# Altium project ESP32_V1.PrjPcb
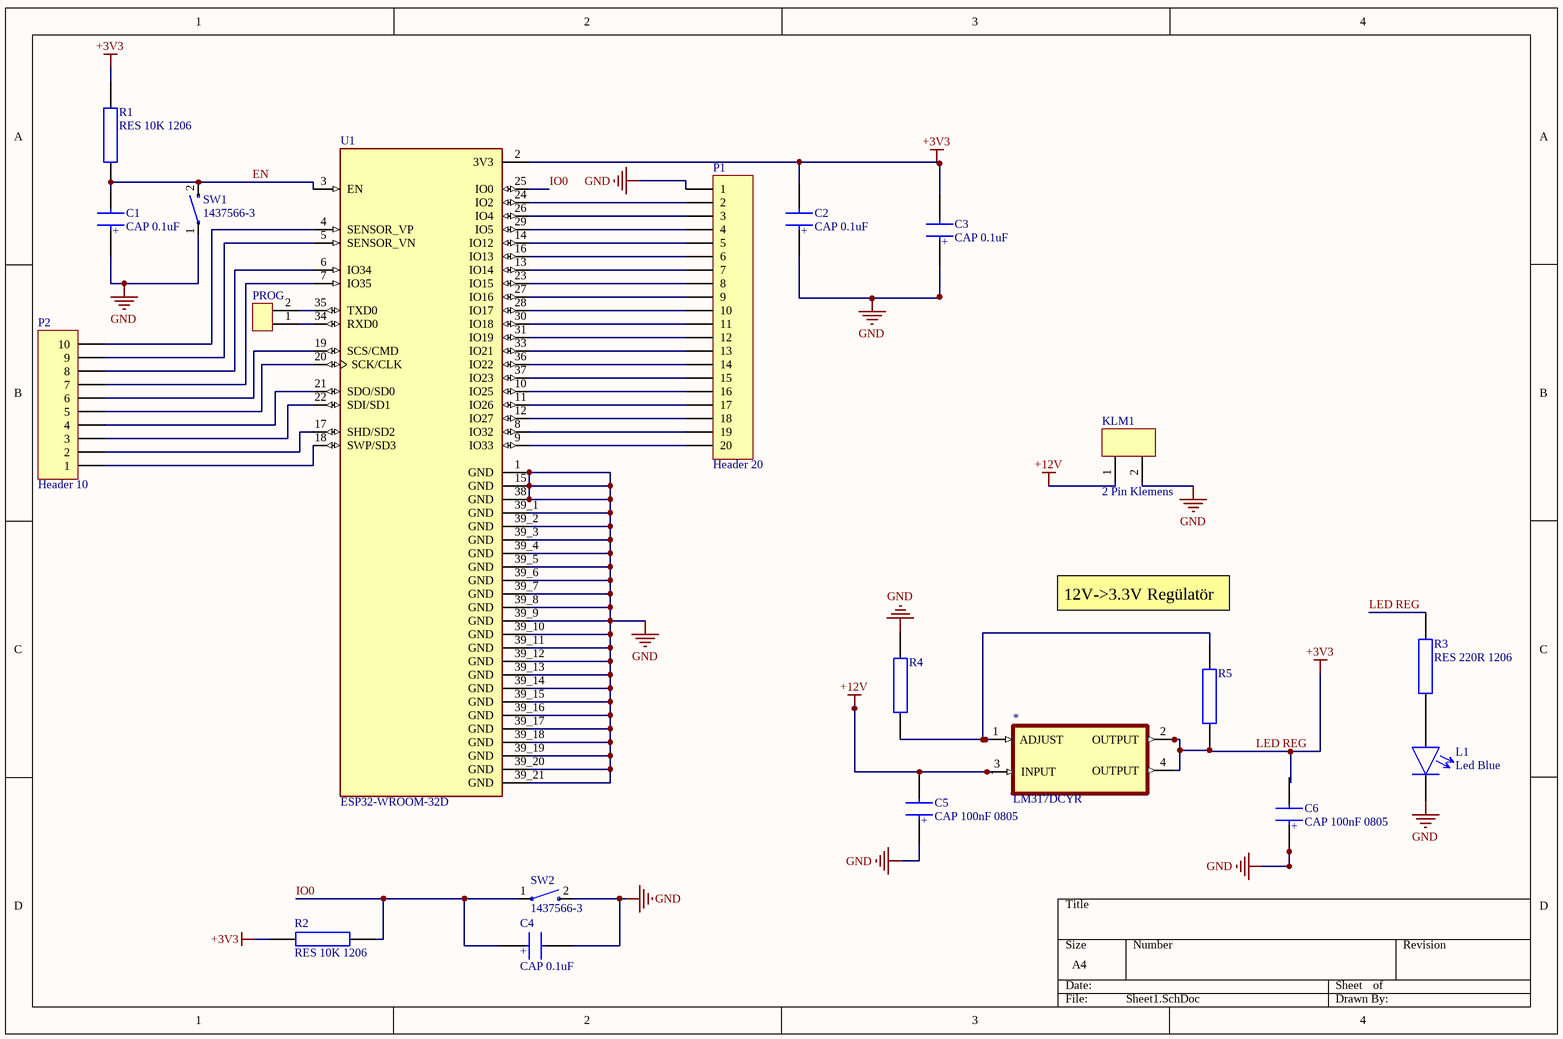
[diagram p0: Sheet1.SchDoc]
1 sheet, 20 parts. Net scope: global (net labels, ports and power ports of the same name join across sheets).
Board file: PCB2.PcbDoc

## Sheet Sheet1.SchDoc
size A4; SheetNumber: 1; SheetTotal: 1

### Parts
*  LM317DCYR  [SOT230P700X180-4N]
C1  CAP 0.1uF  [CAP_805]
C2  CAP 0.1uF  [CAP_805]
C3  CAP 0.1uF  [CAP_805]
C4  CAP 0.1uF  [CAP_805]
C5  CAP 100nF 0805  [CAP_805]
C6  CAP 100nF 0805  [CAP_805]
KLM1  2 Pin Klemens  [5.08mm-2 pin]
L1  Led Blue  [Led 1206]
P1  Header 20  [HDR1X20]
P2  Header 10  [HDR1X10]
PROG  2 Pin Jst Konnektör  [2 pin konnektor]  (value not drawn)
R1  RES 10K 1206  [RES_1206]
R2  RES 10K 1206  [RES_1206]
R3  RES 220R 1206  [RES_1206]
R4  RES 470R 1206  [RES_1206]  (value not drawn)
R5  RES 470R 1206  [RES_1206]  (value not drawn)
SW1  1437566-3  [SW_1437566-3]
SW2  1437566-3  [SW_1437566-3]
U1  ESP32-WROOM-32D  [MODULE_ESP32-WROOM-32D]

### Nets
+12V: *.3(INPUT) C5.2 KLM1.1
GND: C1.1 C2.1 C3.1 C4.2 C5.1 C6.1 KLM1.2 L1.2 P1.1 R4.2 SW1.1 SW2.2 U1.1(GND) U1.15(GND) U1.38(GND) U1.39_1(GND) U1.39_2(GND) U1.39_3(GND) U1.39_4(GND) U1.39_5(GND) U1.39_6(GND) U1.39_7(GND) U1.39_8(GND) U1.39_9(GND) U1.39_10(GND) U1.39_11(GND) U1.39_12(GND) U1.39_13(GND) U1.39_14(GND) U1.39_15(GND) U1.39_16(GND) U1.39_17(GND) U1.39_18(GND) U1.39_19(GND) U1.39_20(GND) U1.39_21(GND)
LED REG: *.2(OUTPUT) *.4(OUTPUT) C2.2 C3.2 R1.2 R2.2 R3.2 R5.1 U1.2(3V3)  [also labelled +3V3]
EN: C1.2 R1.1 SW1.2 U1.3(EN)
IO0: C4.1 R2.1 SW2.1 U1.25(IO0)
Net*_1: *.1(ADJUST) R4.1 R5.2
NetL1_1: L1.1 R3.1
NetP1_2: P1.2 U1.24(IO2)
NetP1_3: P1.3 U1.26(IO4)
NetP1_4: P1.4 U1.29(IO5)
NetP1_5: P1.5 U1.14(IO12)
NetP1_6: P1.6 U1.16(IO13)
NetP1_7: P1.7 U1.13(IO14)
NetP1_8: P1.8 U1.23(IO15)
NetP1_9: P1.9 U1.27(IO16)
NetP1_10: P1.10 U1.28(IO17)
NetP1_11: P1.11 U1.30(IO18)
NetP1_12: P1.12 U1.31(IO19)
NetP1_13: P1.13 U1.33(IO21)
NetP1_14: P1.14 U1.36(IO22)
NetP1_15: P1.15 U1.37(IO23)
NetP1_16: P1.16 U1.10(IO25)
NetP1_17: P1.17 U1.11(IO26)
NetP1_18: P1.18 U1.12(IO27)
NetP1_19: P1.19 U1.8(IO32)
NetP1_20: P1.20 U1.9(IO33)
NetP2_1: P2.1 U1.18(SWP/SD3)
NetP2_2: P2.2 U1.17(SHD/SD2)
NetP2_3: P2.3 U1.22(SDI/SD1)
NetP2_4: P2.4 U1.21(SDO/SD0)
NetP2_5: P2.5 U1.20(SCK/CLK)
NetP2_6: P2.6 U1.19(SCS/CMD)
NetP2_7: P2.7 U1.7(IO35)
NetP2_8: P2.8 U1.6(IO34)
NetP2_9: P2.9 U1.5(SENSOR_VN)
NetP2_10: P2.10 U1.4(SENSOR_VP)
NetPROG_1: PROG.1 U1.34(RXD0)
NetPROG_2: PROG.2 U1.35(TXD0)

Not connected (* = marked no-connect by the designer): C6 2

### Notes on the sheet
- 12V->3.3V Regülatör
- (in symbol CAP 1uF) +
- (in symbol CAP 100nF 0805) +

### Library data of the parts
C1-C4 = CAP 1uF: 0805 smd
C5 C6 = CAP 100nF 0805: 0805 smd
KLM1 = 2 Pin Klemens: 5.08mm 2 pin klemens
P1 = Header 20: Header, 20-Pin; LatestRevisionDate: 17-Jul-2002; LatestRevisionNote: Re-released for DXP Platform.; Publisher: Altium Limited
P2 = Header 10: Header, 10-Pin; LatestRevisionDate: 17-Jul-2002; LatestRevisionNote: Re-released for DXP Platform.; Publisher: Altium Limited
PROG = 2 Pin Jst Konnektör: 2.50 mm 2 pin jst
SW1 SW2 = 1437566-3: Switch Tactile OFF (ON) SPST Rectangular Button Gull Wing 0.05A 12VDC SMD Loose Piece; Price: None; Value: *; Package: None; Availability: Unavailable; MP: 1437566-3
U1 = ESP32-WROOM-32D: Bluetooth, WiFi 802.11b/g/n, Bluetooth v4.2 +EDR, Class 1, 2 and 3 Transceiver Module 2.4GHz ~ 2.5GHz Integrated; MF: Espressif Systems; Price: None; Availability: In Stock; Package: Module Espressif Systems; MP: ESP32-WROOM-32D; Value: *; SnapEDA_Link: https://www.snapeda.com/parts/ESP32-WROOM-32D/Espressif+Systems/view-part/?ref=snap; Purchase-URL: https://pricing.snapeda.com/search/part/ESP32-WROOM-32D/?ref=eda; Check_prices: https://www.snapeda.com/parts/ESP32-WROOM-32D/Espressif+Systems/view-part/?ref=eda